# Altium schematic sheet Overview.SchDoc: PMPi-PCB
size A; SheetNumber: 1; SheetTotal: 6
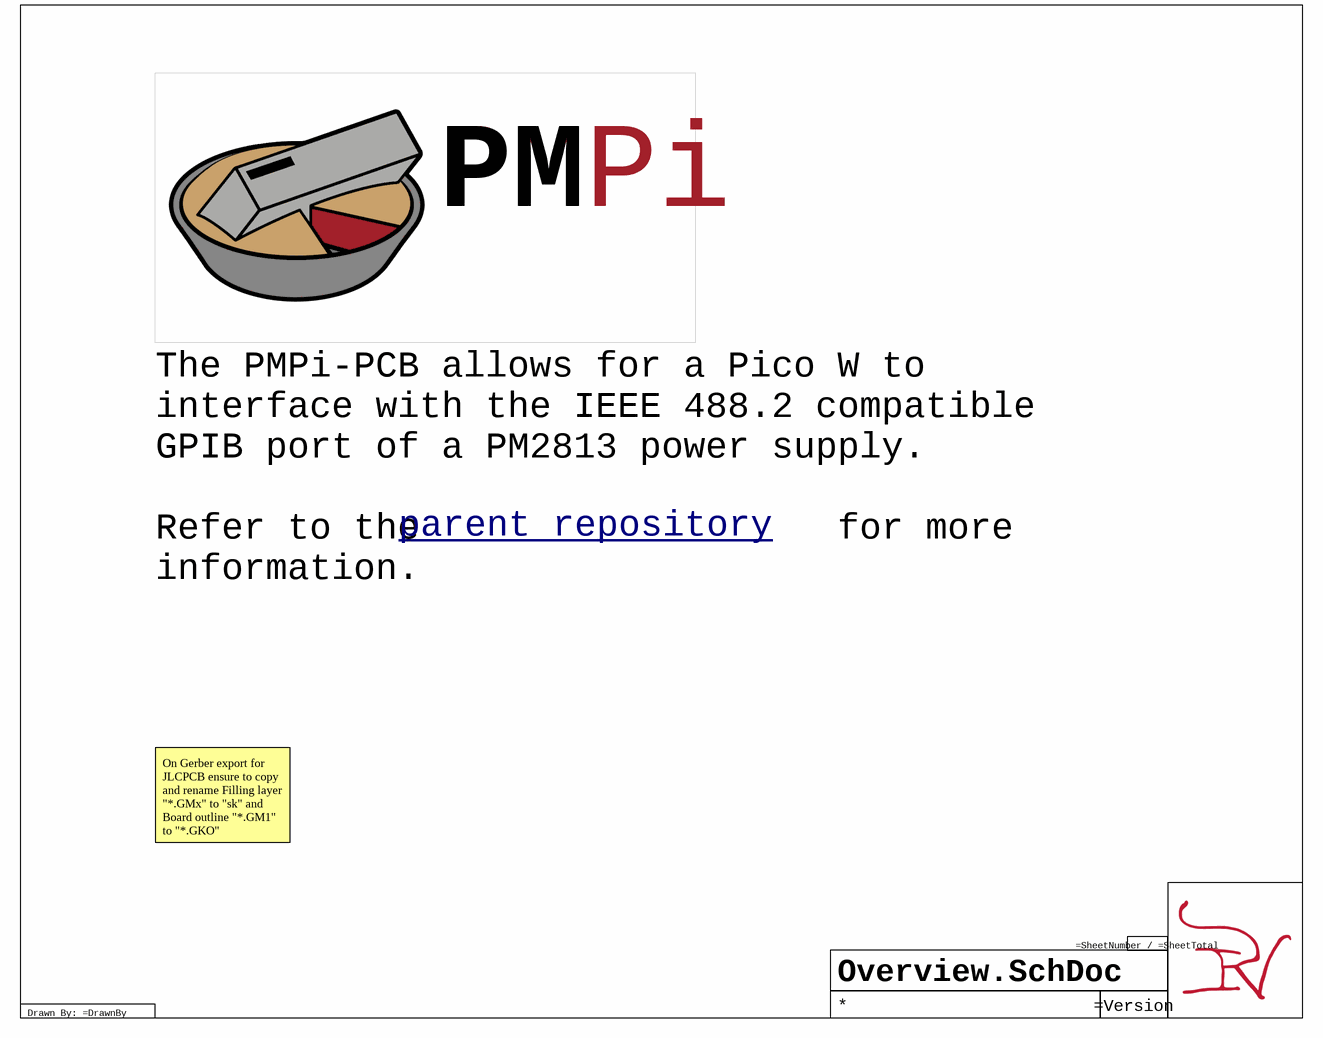
[diagram p0: Overview.SchDoc]

## Sub-sheets
U_PMPi-PCB = PMPi-PCB.SchDoc: no entries

## Notes on the sheet
- PMPi
- PM
- parent repository <https://github.com/LeHuman/PMPi>
- The PMPi-PCB allows for a Pico W to interface with the IEEE 488.2 compatible GPIB port of a PM2813 power supply.
  Refer to the                   for more information.
- On Gerber export for JLCPCB ensure to copy and rename Filling layer "*.GMx" to "sk" and Board outline "*.GM1" to "*.GKO"
- Drawn By: =DrawnBy